# EAGLE design lx9io (EAGLE 7.2.0)
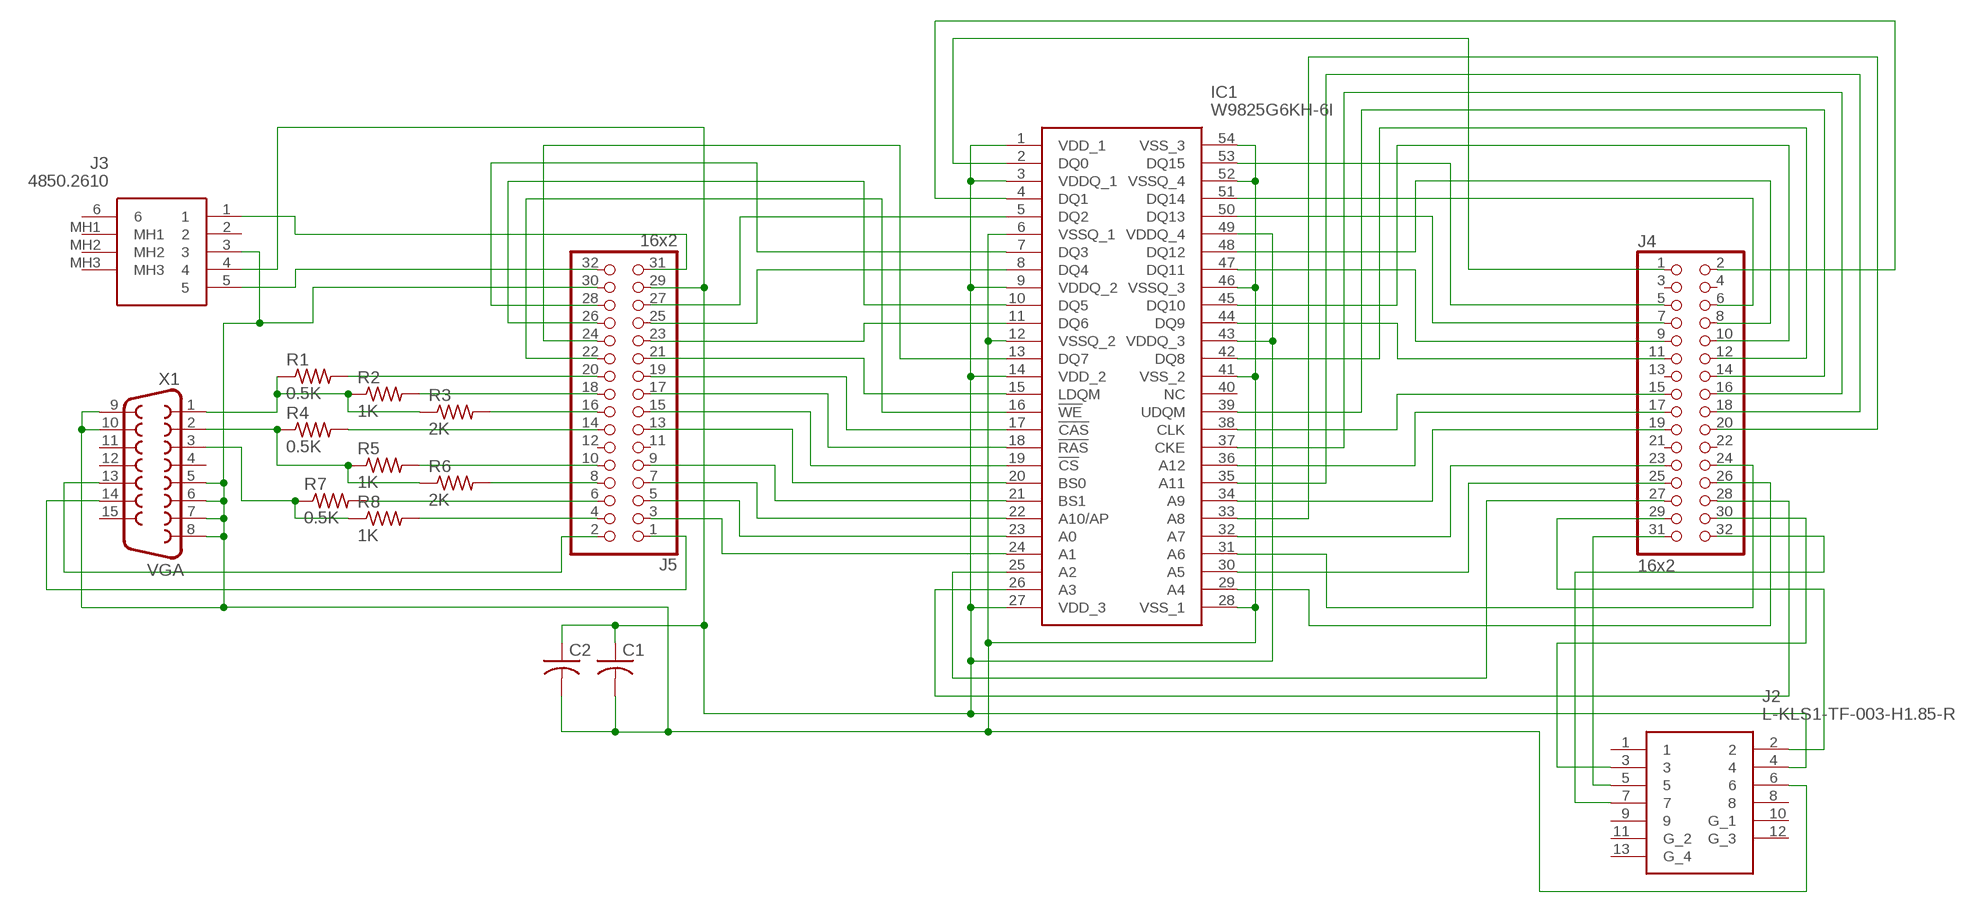
[diagram p0: schematic, sheet 1]

## Parts
C1  C-USC0805  [C0805]
C2  C-USC0805  [C0805]
IC1  W9825G6KH-6I  [SOP80P1176X120-54N]
J2  L-KLS1-TF-003-H1.85-R  [L-KLS1-TF-003-H1.85-R]
J3  4850.2610  [48502610]
J4  16x2  PINHD-2X16  [2X16]
J5  16x2  PINHD-2X16  [2X16]
R1  0.5K  R-US_M0805  [M0805]
R2  1K  R-US_M0805  [M0805]
R3  2K  R-US_M0805  [M0805]
R4  0.5K  R-US_M0805  [M0805]
R5  1K  R-US_M0805  [M0805]
R6  2K  R-US_M0805  [M0805]
R7  0.5K  R-US_M0805  [M0805]
R8  1K  R-US_M0805  [M0805]
X1  VGA  F15HDH  [HDF15H]

## Nets
N$2: IC1.50(DQ13) J4.7
N$3: IC1.2(DQ0) J4.1
N$5: C1.2 C2.2 IC1.6(VSSQ_1) IC1.12(VSSQ_2) IC1.28(VSS_1) IC1.41(VSS_2) IC1.46(VSSQ_3) IC1.52(VSSQ_4) IC1.54(VSS_3) J2.6 J3.3 J5.30 X1.5 X1.6 X1.7 X1.8 X1.9 X1.10
N$7: IC1.53(DQ15) J4.5
N$8: IC1.47(DQ11) J4.9
N$9: IC1.44(DQ9) J4.11
N$11: IC1.38(CLK) J4.15
N$12: IC1.36(A12) J4.17
N$13: IC1.34(A9) J4.19
N$14: IC1.32(A7) J4.23
N$15: IC1.30(A5) J4.25
N$16: IC1.51(DQ14) J4.6
N$17: IC1.48(DQ12) J4.8
N$18: IC1.45(DQ10) J4.10
N$19: IC1.42(DQ8) J4.12
N$20: IC1.39(UDQM) J4.14
N$21: IC1.37(CKE) J4.16
N$22: IC1.35(A11) J4.18
N$23: IC1.33(A8) J4.20
N$24: IC1.31(A6) J4.24
N$25: IC1.29(A4) J4.26
N$26: IC1.4(DQ1) J4.2
N$27: IC1.25(A2) J4.27
N$28: IC1.26(A3) J4.28
N$29: IC1.10(DQ5) J5.26
N$30: IC1.5(DQ2) J5.27
N$31: IC1.7(DQ3) J5.28
N$32: IC1.8(DQ4) J5.25
N$33: IC1.11(DQ6) J5.23
N$34: IC1.13(DQ7) J5.24
N$35: IC1.15(LDQM) J5.21
N$36: IC1.16(!WE) J5.22
N$37: IC1.17(!CAS) J5.19
N$38: IC1.18(!RAS) J5.17
N$39: IC1.19(!CS) J5.15
N$40: IC1.20(BS0) J5.13
N$41: IC1.21(BS1) J5.9
N$42: IC1.22(A10/AP) J5.7
N$43: IC1.23(A0) J5.5
N$44: IC1.24(A1) J5.3
N$45: R1.1 R2.1 R3.1 X1.1
N$46: R4.1 R5.1 R6.1 X1.2
N$47: R7.1 R8.1 X1.3
N$48: J5.20 R1.2
N$50: J5.18 R2.2
N$51: J5.16 R3.2
N$52: J5.14 R4.2
N$53: J5.10 R5.2
N$54: J5.8 R6.2
N$55: J5.6 R7.2
N$56: J5.4 R8.2
N$57: J5.1 X1.14
N$58: J3.1 J5.31
N$59: J3.5 J5.32
N$60: J5.2 X1.13
N$62: C1.1 C2.1 IC1.1(VDD_1) IC1.3(VDDQ_1) IC1.9(VDDQ_2) IC1.14(VDD_2) IC1.27(VDD_3) IC1.43(VDDQ_3) IC1.49(VDDQ_4) J2.4 J3.4 J5.29
N$64: J2.5 J4.31
N$65: J2.7 J4.32
N$67: J2.2 J4.29
N$68: J2.3 J4.30
Unconnected: IC1.40(NC) J2.1 J2.8 J2.9 J2.10(G_1) J2.11(G_2) J2.12(G_3) J2.13(G_4) J3.2 J3.6 J3.MH1 J3.MH2 J3.MH3 J4.3 J4.4 J4.13 J4.21 J4.22 J5.11 J5.12 X1.4 X1.11 X1.12 X1.15

## Library data of the parts
C1 C2 = adafruit:C-US: CAPACITOR, American symbol
IC1 = W9825G6KH-6I:W9825G6KH-6I: Winbond W9825G6KH-6I, SDRAM 256Mbit Surface Mount, 166MHz, 54-Pin TSOP Source: Datasheet <http://www.winbond.com/resource-files/w9825g6kh_a04.pdf>; DESCRIPTION: Winbond W9825G6KH-6I, SDRAM 256Mbit Surface Mount, 166MHz, 54-Pin TSOP; HEIGHT: 1.2mm; MANUFACTURER_NAME: Winbond; MANUFACTURER_PART_NUMBER: W9825G6KH-6I; MOUSER_PART_NUMBER: 454-W9825G6KH-6I; MOUSER_PRICE-STOCK: https://www.mouser.com/Search/Refine.aspx?Keyword=454-W9825G6KH-6I; RS_PART_NUMBER: 1882632; RS_PRICE-STOCK: http://uk.rs-online.com/web/p/products/1882632
J2 = L-KLS1-TF-003-H1.85-R:L-KLS1-TF-003-H1.85-R: Micro SD Card Connector Source: Datasheet <https://img.ozdisan.com/ETicaret_Dosya/476392_7149645.pdf>; DESCRIPTION: Micro SD Card Connector; HEIGHT: mm; MANUFACTURER_NAME: KLS Electronic; MANUFACTURER_PART_NUMBER: L-KLS1-TF-003-H1.85-R
J3 = mini_din_4850.2610:4850.2610: SCHURTER - 4850.2610 - RECEPTACLE, MINI-DIN, PCB, THT, RA, 6WAY Source: Datasheet <http://www.schurterinc.com/bundles/snceschurter/epim/_ProdPool_/newDS/en/typ_4850.2610.pdf>; ALLIED_NUMBER: 70597687; ALLIED_PRICE-STOCK: https://www.alliedelec.com/schurter-4850-2610/70597687/; DESCRIPTION: SCHURTER - 4850.2610 - RECEPTACLE, MINI-DIN, PCB, THT, RA, 6WAY; HEIGHT: 12mm; MANUFACTURER_NAME: SCHURTER; MANUFACTURER_PART_NUMBER: 4850.2610; MOUSER_PART_NUMBER: 693-4850.2610; MOUSER_PRICE-STOCK: https://www.mouser.com/Search/Refine.aspx?Keyword=693-4850.2610
J4 J5 = pinhead:PINHD-2X16: PIN HEADER
R1-R8 = adafruit:R-US_: RESISTOR, American symbol
X1 = adafruit:F15: SUB-D HDH is also known as a 'right angle VGA' connector

## Board
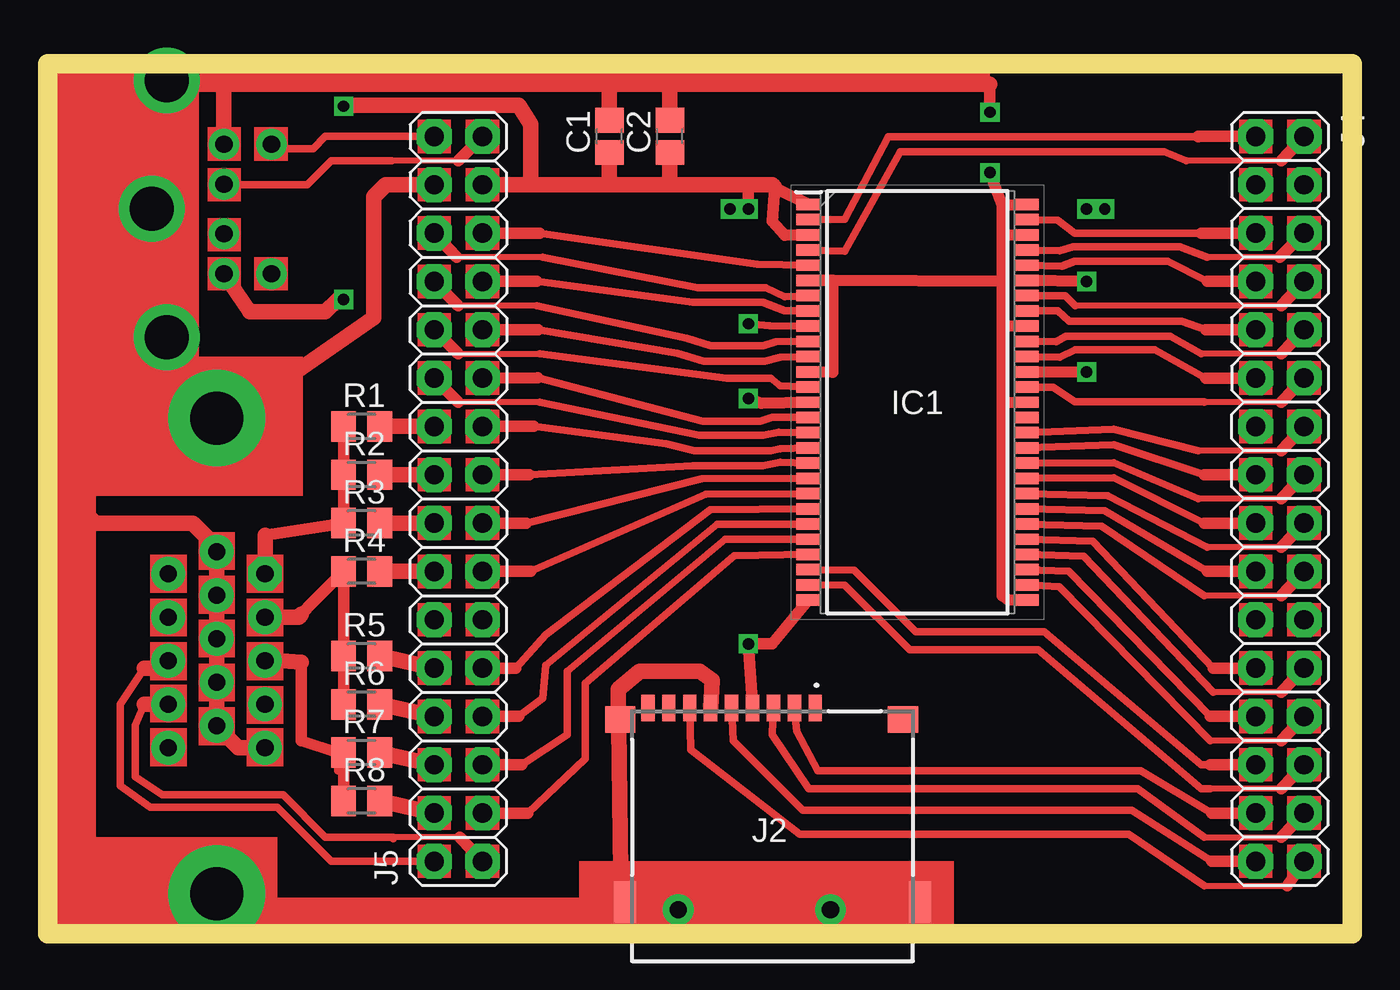
[diagram p1: board, top side]
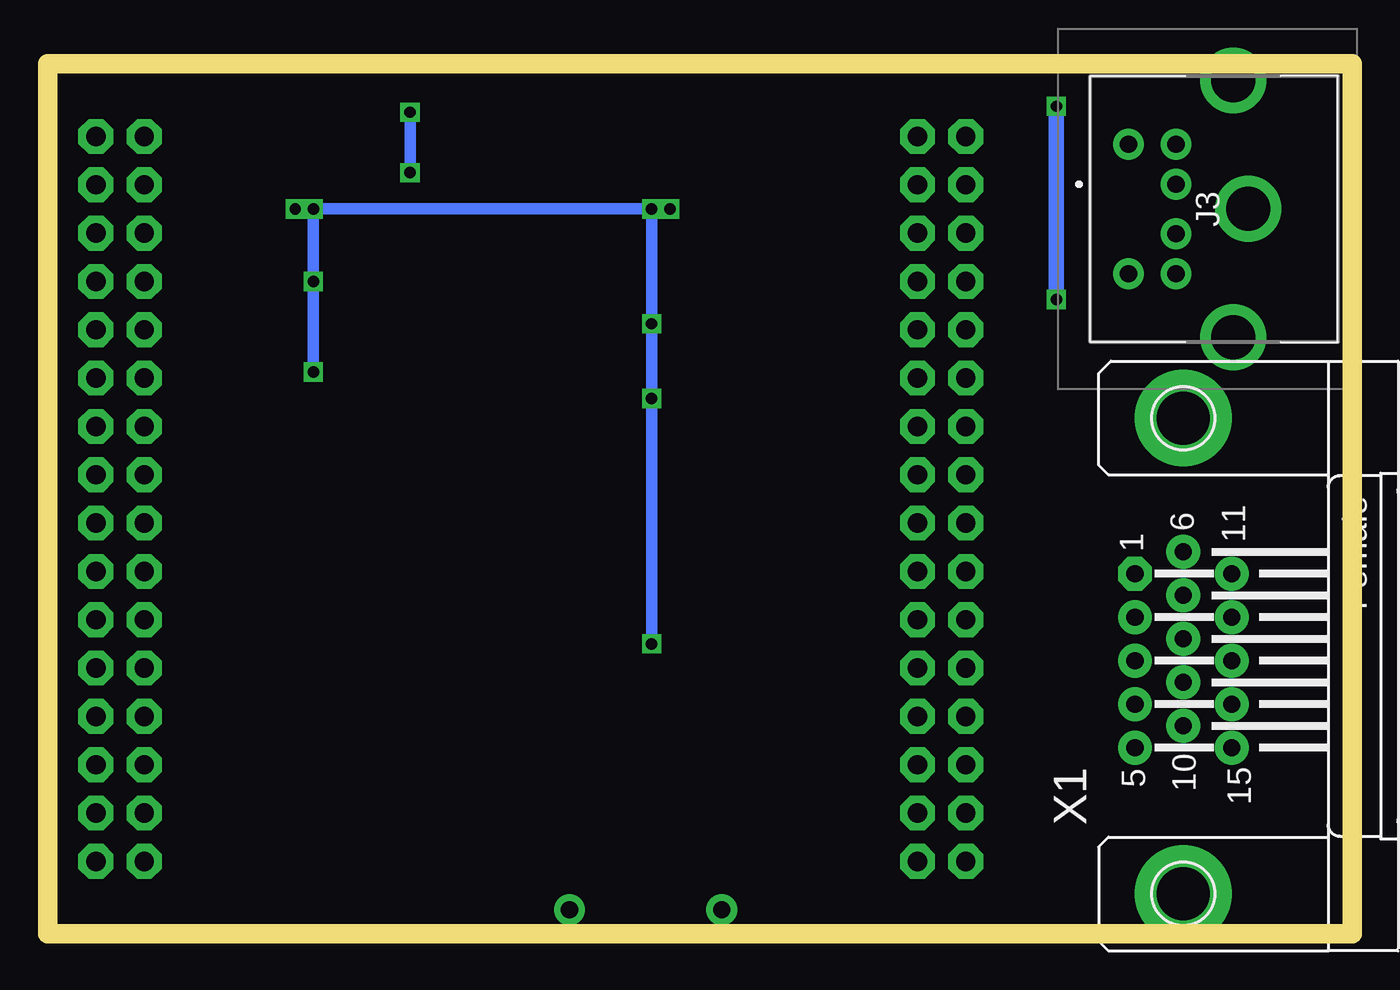
[diagram p2: board, bottom side, seen from below]

Size 68.58 x 45.72 mm. Coordinates in mm from the lower left corner, seen from the top.
Outline: 0,0 68.56,0 68.58,45.72 0,45.72 0,0
Copper layers (1*16): Top 0.035mm / dielectric 1.5mm / Bottom 0.035mm
Design rules "smd_default": minimum track width 10mil, minimum drill 24mil, track to track 6mil, track to pad 6mil, pad to pad 6mil, via to via 6mil, smd to smd 6mil, copper to edge 40mil, drill to drill 8mil, minimum pad ring 10mil, minimum via ring 8mil, stop-mask expansion 4mil, vias tented up to drill 0mil, thermal gap 10mil
Milling: 4 lines

### Footprints (pad centres in the part's own frame; a part is rotated, then mirrored left to right if it is on the bottom)
C0805 = smd 1.3 x 1.5: 1 -0.85,0; 2 0.85,0
SOP80P1176X120-54N = smd 1.295 x 0.6: 1 -5.728,10.4; 2 -5.728,9.6; 3 -5.728,8.8; 4 -5.728,8; 5 -5.728,7.2; 6 -5.728,6.4; 7 -5.728,5.6; 8 -5.728,4.8; 9 -5.728,4; 10 -5.728,3.2; 11 -5.728,2.4; 12 -5.728,1.6; 13 -5.728,0.8; 14 -5.728,0; 15 -5.728,-0.8; 16 -5.728,-1.6; 17 -5.728,-2.4; 18 -5.728,-3.2; 19 -5.728,-4; 20 -5.728,-4.8; 21 -5.728,-5.6; 22 -5.728,-6.4; 23 -5.728,-7.2; 24 -5.728,-8; 25 -5.728,-8.8; 26 -5.728,-9.6; 27 -5.728,-10.4; 28 5.728,-10.4; 29 5.728,-9.6; 30 5.728,-8.8; 31 5.728,-8; 32 5.728,-7.2; 33 5.728,-6.4; 34 5.728,-5.6; 35 5.728,-4.8; 36 5.728,-4; 37 5.728,-3.2; 38 5.728,-2.4; 39 5.728,-1.6; 40 5.728,-0.8; 41 5.728,0; 42 5.728,0.8; 43 5.728,1.6; 44 5.728,2.4; 45 5.728,3.2; 46 5.728,4; 47 5.728,4.8; 48 5.728,5.6; 49 5.728,6.4; 50 5.728,7.2; 51 5.728,8; 52 5.728,8.8; 53 5.728,9.6; 54 5.728,10.4
L-KLS1-TF-003-H1.85-R = smd 0.7 x 1.4: 1 2.25,10.6; 2 1.15,10.6; 3 0.05,10.6; 4 -1.05,10.6; 5 -2.15,10.6; 6 -3.25,10.6; 7 -4.35,10.6; 8 -5.45,10.6; 9 -6.55,10.6 | smd 1.6 x 1.4: 10 -8,10; 13 6.85,10 | smd 1.2 x 2.2: 11 -7.75,0.4; 12 7.75,0.4 | drill 0.9 pad 1.4: 14 3.05,0; 15 -4.95,0
48502610 = drill 0.9 pad 1.4: 1 1.3,1.65; 2 -1.3,1.65; 3 3.4,1.65; 4 -3.4,1.65; 5 3.4,4.15; 6 -3.4,4.15 | drill 2.309 pad 3.463: MH1 -6.75,-1.35; MH2 6.75,-1.35; MH3 0,-2.15
2X16 = drill 1.016 octagon: 1 -19.05,-1.27; 2 -19.05,1.27; 3 -16.51,-1.27; 4 -16.51,1.27; 5 -13.97,-1.27; 6 -13.97,1.27; 7 -11.43,-1.27; 8 -11.43,1.27; 9 -8.89,-1.27; 10 -8.89,1.27; 11 -6.35,-1.27; 12 -6.35,1.27; 13 -3.81,-1.27; 14 -3.81,1.27; 15 -1.27,-1.27; 16 -1.27,1.27; 17 1.27,-1.27; 18 1.27,1.27; 19 3.81,-1.27; 20 3.81,1.27; 21 6.35,-1.27; 22 6.35,1.27; 23 8.89,-1.27; 24 8.89,1.27; 25 11.43,-1.27; 26 11.43,1.27; 27 13.97,-1.27; 28 13.97,1.27; 29 16.51,-1.27; 30 16.51,1.27; 31 19.05,-1.27; 32 19.05,1.27
M0805 = smd 1.3 x 1.6: 1 -0.95,0; 2 0.95,0
HDF15H = drill 0.9 pad 1.778 octagon: 1 4.329,2.54 | drill 0.9 pad 1.778: 2 2.043,2.54; 3 -0.243,2.54; 4 -2.529,2.54; 5 -4.815,2.54; 6 5.472,0; 7 3.186,0; 8 0.9,0; 9 -1.386,0; 10 -3.672,0; 11 4.329,-2.54; 12 2.043,-2.54; 13 -0.243,-2.54; 14 -2.529,-2.54; 15 -4.815,-2.54 | drill 2.8 pad 5.08: P$1 -12.5,0; P$2 12.5,0

### Placement (x,y rotation side)
C1  29.53,41.91 90 top
C2  32.7,41.91 90 top
IC1  45.72,27.94 0 top
J2  38.1,1.27 0 top
J3  7.62,38.1 90 bottom
J4  64.77,22.86 270 top
J5  21.59,22.86 90 top
R1  16.51,26.67 0 top
R2  16.51,24.13 0 top
R3  16.51,21.59 0 top
R4  16.51,19.05 0 top
R5  16.51,14.61 0 top
R6  16.51,12.06 0 top
R7  16.51,9.53 0 top
R8  16.51,6.99 0 top
X1  8.89,14.61 90 bottom

### Tracks (layer width: path | path; a pad name or v marks a point on that pad's centre or on a via)
N$2
  Top 0.406: 60.96,34.29 58.88,35.34 53.98,35.34 53.3,35.1 IC1.50
  Top 0.61: J4.7 60.96,34.29
N$3
  Top 0.406: IC1.2 41.91,37.56 44.19,41.9 60.48,41.9
  Top 0.61: J4.1 60.48,41.91 60.48,41.9
N$5  (via drill 0.6)
  Top 0.61: IC1.28 50.48,17.56 50.16,17.78 50.16,27.92 | 50.16,27.92 50.16,31.95 | 50.16,31.95 50.16,34.29 | 50.16,34.29 50.16,36.73 | 50.16,36.73 50.16,38.3 | 50.16,38.3 IC1.54 | IC1.41 50.16,27.92 | IC1.52 50.16,36.73 | IC1.46 50.16,31.95 | IC1.12 41.27,29.53 41.27,34.34 | 41.27,34.34 50.16,34.29 | 49.53,44.65 v49.53,43.18 | v49.53,40.01 50.16,38.3 | 41.27,34.34 IC1.6
  Top 0.813: X1.5 10.03,9.79 X1.10 X1.9 X1.8 X1.7 X1.6 8.89,20.32 7.62,21.59 2.54,21.59 1.27,22.86 | 1.27,22.86 1.27,29.21 | 1.27,29.21 1.27,34.29 | 1.27,34.29 1.27,44.65 9.21,44.65 | 9.21,44.65 29.53,44.65 | 29.53,44.65 32.7,44.65 | 32.7,44.65 49.53,44.65 | 33.02,1.27 30.16,1.27 | 30.16,1.27 2.54,1.27 1.27,2.54 1.27,22.86 | 1.68,34.7 1.27,34.29 | J2.6 34.92,13.34 34.29,13.81 31.11,13.81 30,12.86 30.16,1.27 | J5.30 17.78,39.37 17.14,38.73 17.14,32.38 13.02,29.53 1.59,29.53 1.27,29.21 | J3.3 9.27,44.59 9.21,44.65 | C1.2 29.53,44.65 | C2.2 32.7,44.65
  Bottom 0.61: v49.53,43.18 v49.53,40.01
N$6  (via drill 0.6)
  other vias: 54.61,29.53
N$7
  Top 0.406: IC1.53 53.1,37.5 53.98,36.83 60.64,36.83
  Top 0.61: J4.5 60.64,36.83
N$8
  Top 0.406: IC1.47 53.08,32.74 53.7,32.2 59.6,32.2 60.87,31.75
  Top 0.61: J4.9 60.87,31.75
N$9
  Top 0.406: 60.88,29.21 58.2,30.7 54,30.7 53.2,30.3 IC1.44
  Top 0.61: J4.11 60.88,29.21
N$11
  Top 0.406: 60.8,24.13 56.04,25.72 IC1.38
  Top 0.61: J4.15 60.8,24.13
N$12
  Top 0.406: 60.8,21.59 56.04,23.97 IC1.36
  Top 0.61: J4.17 60.8,21.59
N$13
  Top 0.406: 60.96,19.05 55.56,22.23 IC1.34
  Top 0.61: J4.19 60.96,19.05
N$14
  Top 0.406: 61.28,13.97 54.93,20.64 IC1.32
  Top 0.61: J4.23 61.28,13.97
N$15
  Top 0.406: 61.12,11.43 53.66,19.05 IC1.30
  Top 0.61: J4.25 61.12,11.43
N$16
  Top 0.305: 64.77,35.56 60.96,35.56
  Top 0.406: IC1.51 53.2,35.9 53.9,36.1 59.5,36.1 60.96,35.56
  Top 0.61: J4.6 64.77,35.56
N$17
  Top 0.305: 64.85,33.02 54.02,33.02
  Top 0.406: 54.02,33.02 53.48,33.54 IC1.48
  Top 0.61: J4.8 64.85,33.02
N$18
  Top 0.305: 64.85,30.48 60.64,30.48
  Top 0.406: 60.64,30.48 59,31.4 53.5,31.4 53.02,31.11 IC1.45
  Top 0.61: J4.10 64.85,30.48
N$19
  Top 0.305: 64.85,27.94 60.8,27.94
  Top 0.406: IC1.42 52.86,28.73 53.98,27.96 60.8,27.96 60.8,27.94
  Top 0.61: J4.12 64.85,27.94
N$20
  Top 0.305: 64.85,25.4 60.48,25.4
  Top 0.406: 60.48,25.4 56.04,26.51 IC1.39
  Top 0.61: J4.14 64.85,25.4
N$21
  Top 0.305: 64.85,22.86 60.48,22.86
  Top 0.406: 60.48,22.86 56.04,24.77 IC1.37
  Top 0.61: J4.16 64.85,22.86
N$22
  Top 0.305: 64.85,20.32 60.96,20.32
  Top 0.406: 60.96,20.32 55.72,23.02 IC1.35
  Top 0.61: J4.18 64.85,20.32
N$23
  Top 0.305: 64.85,17.78 60.8,17.78
  Top 0.406: 60.8,17.78 55.4,21.43 IC1.33
  Top 0.61: J4.20 64.85,17.78
N$24
  Top 0.305: 64.85,12.7 61.28,12.7
  Top 0.406: 61.28,12.7 54.45,19.84 IC1.31
  Top 0.61: J4.24 64.85,12.7
N$25
  Top 0.305: 64.85,10.16 61.12,10.16
  Top 0.406: 61.12,10.16 53.18,18.26 IC1.29
  Top 0.61: J4.26 64.85,10.16
N$26
  Top 0.305: 64.85,40.64 59.85,40.64
  Top 0.406: 59.85,40.64 58.7,41.1 44.81,41.1 41.91,35.88 IC1.4
  Top 0.61: J4.2 64.85,40.64
N$27
  Top 0.406: IC1.25 42.39,19.11 45.62,15.88 52.39,15.88 60.64,8.89 61.12,8.89
  Top 0.61: J4.27 61.12,8.89
N$28
  Top 0.305: 64.85,7.62 61.12,7.62
  Top 0.406: IC1.26 41.91,18.32 45.3,14.92 52.07,14.92 60.64,7.62 61.12,7.62
  Top 0.61: J4.28 64.85,7.62
N$29
  Top 0.305: 25.72,33.02 21.59,33.02
  Top 0.406: IC1.10 38.26,31.11 37.62,30.91 34.85,30.91 33.58,31.29 25.72,33.02
  Top 0.61: 21.59,33.02 J5.26
N$30
  Top 0.406: IC1.5 37.31,35.18 25.88,36.83
  Top 0.61: 25.88,36.83 J5.27
N$31
  Top 0.305: 26.04,35.56 21.51,35.56
  Top 0.406: IC1.7 38.73,33.5 37.76,33.95 34.18,33.95 26.04,35.56
  Top 0.61: 21.51,35.56 J5.28
N$32
  Top 0.406: IC1.8 38.73,32.75 37.6,33.2 33.9,33.2 25.72,34.29
  Top 0.61: 25.72,34.29 J5.25
N$33
  Top 0.406: 25.8,31.75 33.09,30.52 34.5,30.1 37.7,30.1 38.5,30.3 IC1.11
  Top 0.61: J5.23 25.8,31.75
N$34
  Top 0.305: 21.57,30.48 25.88,30.48
  Top 0.406: 25.88,30.48 35.7,29.2 38,29.2 38.5,28.8 IC1.13
  Top 0.61: J5.24 21.57,30.48
N$35
  Top 0.406: IC1.15 38.1,27.15 37.47,26.93 34.44,26.93 25.77,29.22
  Top 0.61: 25.77,29.22 J5.21
N$36
  Top 0.305: 25.88,27.94 21.59,27.94
  Top 0.406: IC1.16 38.42,26.35 37.62,26.19 34.26,26.19 25.88,27.94
  Top 0.61: 21.59,27.94 J5.22
N$37
  Top 0.406: 25.56,26.67 32.52,25.76 34,25.4 38,25.4 38.5,25.5 IC1.17
  Top 0.61: 25.56,26.67 J5.19
N$38
  Top 0.406: IC1.18 38.5,24.8 37.6,24.6 33.9,24.6 25.32,24.13
  Top 0.61: J5.17 25.32,24.13
N$39
  Top 0.406: 25.16,21.59 34.39,23.91 IC1.19
  Top 0.61: J5.15 25.16,21.59
N$40
  Top 0.406: 25.4,19.05 34.6,23.1 IC1.20
  Top 0.61: J5.13 25.4,19.05
N$41
  Top 0.406: 24.61,13.97 26.19,15.72 34.82,22.28 IC1.21
  Top 0.61: J5.9 24.61,13.97
N$42
  Top 0.406: 24.77,11.43 26.04,12.38 26.19,14.13 35.21,21.53 IC1.22
  Top 0.61: J5.7 24.77,11.43
N$43
  Top 0.406: 24.92,8.89 27.3,10.48 27.3,13.81 35.62,20.74 IC1.23
  Top 0.61: J5.5 24.92,8.89
N$44
  Top 0.406: 25.24,6.35 28.26,9.21 28.26,13.18 36.08,19.89 IC1.24
  Top 0.61: J5.3 25.24,6.35
N$45
  Top 0.406: X1.1 11.43,19.05
  Top 0.61: 11.43,20.95 R3.1 R2.1 R1.1
  Top 0.813: 11.43,19.05 11.43,20.95
N$46
  Top 0.61: R6.1 R5.1 R4.1 13.97,17.46 13.34,16.79
  Top 0.813: X1.2 13.2,16.65 13.34,16.79
N$47
  Top 0.406: 15.24,9.53 15.24,8.57 R7.1
  Top 0.61: 13.34,14.29 13.34,10.16 15.24,9.53 | R7.1 R8.1
  Top 0.813: X1.3 12.31,14.36 13.34,14.29
N$48
  Top 0.813: J5.20 R1.2
N$49  (via drill 0.6)
  other vias: 55.56,38.1
N$50
  Top 0.813: J5.18 R2.2
N$51
  Top 0.813: J5.16 R3.2
N$52
  Top 0.813: J5.14 R4.2
N$53
  Top 0.813: J5.10 R5.2
N$54
  Top 0.813: J5.8 R6.2
N$55
  Top 0.813: J5.6 R7.2
N$56
  Top 0.813: J5.4 R8.2
N$57
  Top 0.305: 21.67,5.08 18.18,5.08
  Top 0.406: 5.08,12.06 4.6,10.95 4.6,8.26 6.03,7.3 12.38,7.3 14.61,5.08 18.18,5.08 18.18,5 | 6.34,12.06 X1.14
  Top 0.61: J5.1 21.67,5.08
  Top 0.813: 5.08,12.06 6.34,12.06
N$58
  Top 0.305: 21.59,40.64 18.1,40.64
  Top 0.406: J3.1 9.3,39.37 13.65,39.37 14.92,40.64 18.1,40.64
  Top 0.61: J5.31 21.59,40.64
N$59
  Top 0.406: J5.32 14.61,41.91 13.97,41.27 11.99,41.27 J3.5
N$60
  Top 0.406: J5.2 14.92,3.81 12.06,6.67 5.4,6.67 3.81,7.78 3.81,12.06 5.08,13.97 | 5.96,13.97 X1.13
  Top 0.813: 5.08,13.97 5.96,13.97
N$61  (via drill 0.6)
  other vias: 35.88,38.1
N$62  (via drill 0.6)
  Top 0.406: IC1.9 37.95,31.95 v36.83,32.07
  Top 0.61: IC1.1 38.21,39.23 38.1,37.47 38.73,36.73 IC1.3 | J2.4 v36.83,15.24 38.1,15.24 IC1.27 | v36.83,38.1 36.83,39.37 | IC1.43 v54.61,29.53 | IC1.49 v54.61,34.29 | IC1.14 37.5,27.9 v36.83,28.14
  Top 0.813: 25.4,39.37 25.4,42.55 24.77,43.54 15.6,43.54 v15.56,43.5 | J5.29 25.4,39.37 | 25.4,39.37 29.53,39.37 | 29.53,39.37 32.7,39.37 | 32.7,39.37 36.83,39.37 38.1,39.37 38.21,39.23 | v15.56,33.34 15.24,33.34 14.61,32.7 10.63,32.7 J3.4 | C1.1 29.53,39.37 | C2.1 32.7,39.37
  Bottom 0.61: v36.83,15.24 v36.83,28.14 v36.83,32.07 v36.83,38.1 v54.61,38.1 v54.61,34.29 v54.61,29.53
  Bottom 0.813: v15.56,43.5 v15.56,33.34
N$64
  Top 0.406: J2.5 36.04,10.16 39.69,6.51 56.99,6.51 61.2,3.81
  Top 0.61: 61.2,3.81 J4.31
N$65
  Top 0.305: 60.8,2.54 65.17,2.54
  Top 0.406: J2.7 33.81,9.68 39.53,5.24 56.83,5.24 60.8,2.54
  Top 0.61: 65.17,2.54 J4.32
N$67
  Top 0.406: J2.2 39.37,10.64 40.48,8.57 57.47,8.57 61.2,6.35
  Top 0.61: 61.2,6.35 J4.29
N$68
  Top 0.305: 60.8,5.08 64.85,5.08
  Top 0.406: J2.3 38.1,10.48 40.01,7.62 57.31,7.62 60.8,5.08
  Top 0.61: 64.85,5.08 J4.30
(copper drawn outside any net)
  shapes: Top area x93